# Altium schematic sheet USBC.SchDoc
size A4; SheetNumber: 3; SheetTotal: 8
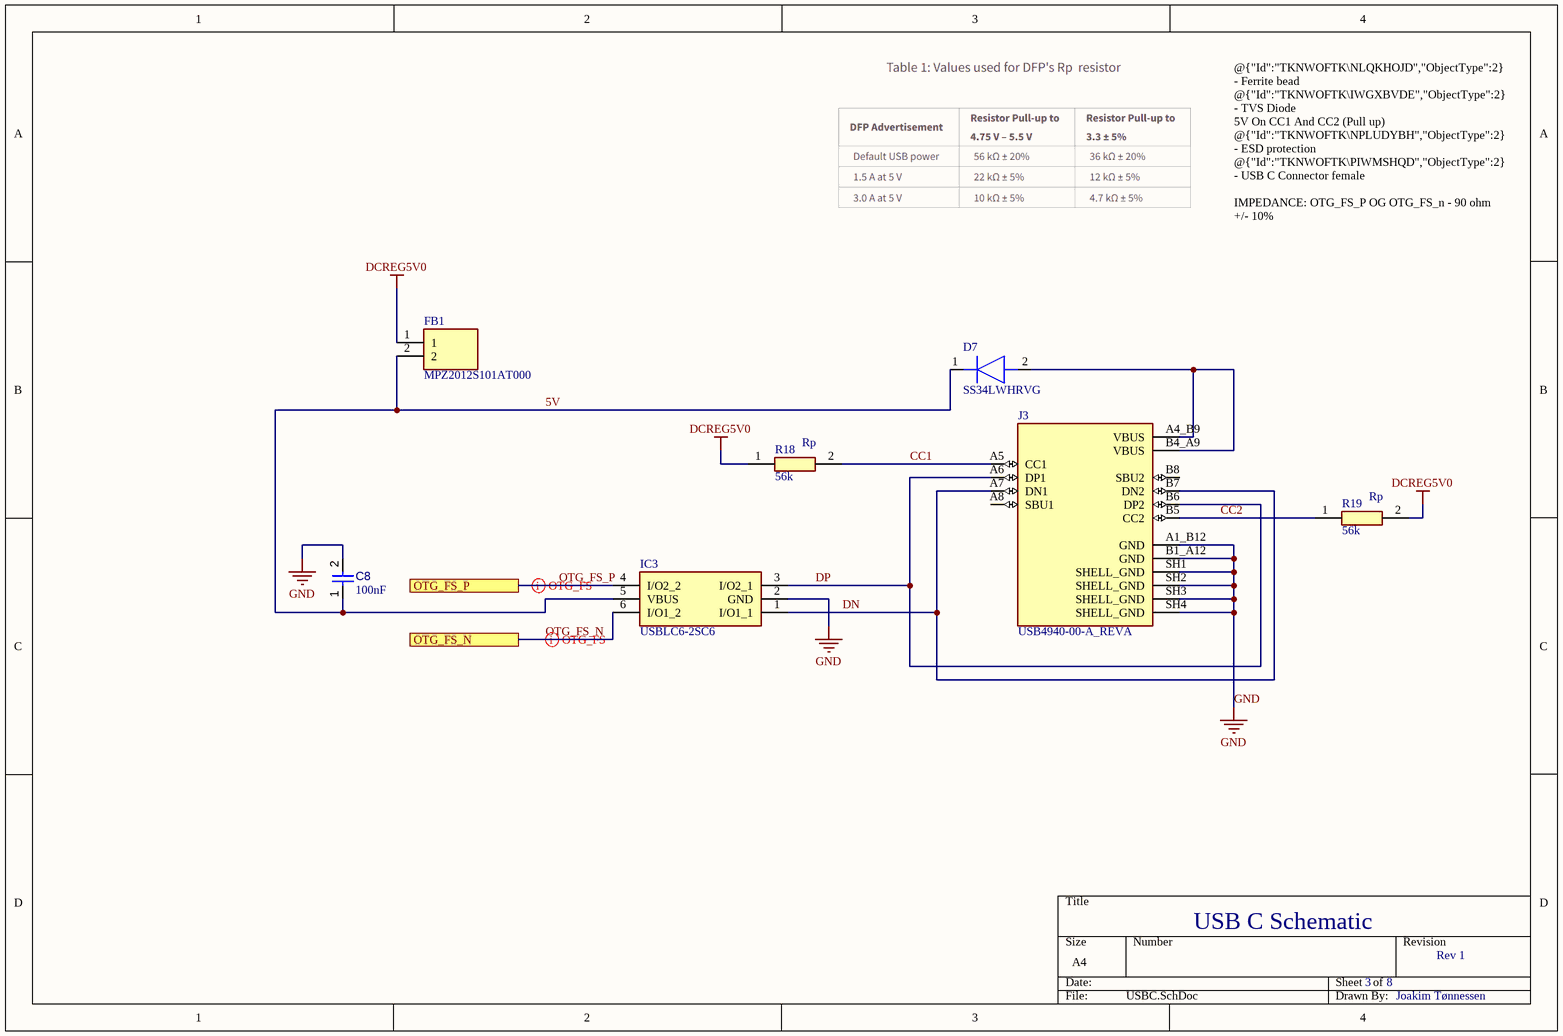
[diagram p0: USBC.SchDoc]

## Parts
C8  value 100nF  [CAPC2012X09N]  (hidden comment: 08053C104JAZ2A)
D7  SS34LWHRVG  [SODFL3718X102N]
FB1  MPZ2012S101AT000  [BEADC2012X105N]
IC3  USBLC6-2SC6  [SOT95P280X145-6N]
J3  USB4940-00-A_REVA  [GCT_USB4940-00-A_REVA]
R18  56k  [RESC1608X50N]
R19  56k  [RESC1608X50N]

## Ports
OTG_FS_N, OTG_FS_P

## Nets
DCREG5V0: FB1.1 R18.1 R19.2
GND: C8.2 IC3.2(GND) J3.A1_B12(GND) J3.B1_A12(GND) J3.SH1(SHELL_GND) J3.SH2(SHELL_GND) J3.SH3(SHELL_GND) J3.SH4(SHELL_GND)
5V: C8.1 D7.1(K) FB1.2 IC3.5(VBUS)
CC1: J3.A5(CC1) R18.2
CC2: J3.B5(CC2) R19.1
DN: IC3.1(I/O1_1) J3.A7(DN1) J3.B7(DN2)
DP: IC3.3(I/O2_1) J3.A6(DP1) J3.B6(DP2)
OTG_FS_N: IC3.6(I/O1_2) ; port OTG_FS_N
OTG_FS_P: IC3.4(I/O2_2) ; port OTG_FS_P
NetD7_2: D7.2(A) J3.A4_B9(VBUS) J3.B4_A9(VBUS)

Not connected (* = marked no-connect by the designer): J3 A8(SBU1) B8(SBU2)

## Layout directives
differential pair: OTG_FS_N, OTG_FS_P

## Notes on the sheet
- @{"Id":"TKNWOFTK\NLQKHOJD","ObjectType":2} - Ferrite bead
  @{"Id":"TKNWOFTK\IWGXBVDE","ObjectType":2} - TVS Diode
  5V On CC1 And CC2 (Pull up)
  @{"Id":"TKNWOFTK\NPLUDYBH","ObjectType":2} - ESD protection
  @{"Id":"TKNWOFTK\PIWMSHQD","ObjectType":2} - USB C Connector female
  IMPEDANCE: OTG_FS_P OG OTG_FS_n - 90 ohm +/- 10%
- (near R18) Rp
- (near R19) Rp
- USB C Schematic
- 3
- 8
- Rev 1
- Joakim Tønnessen

## Library data of the parts
C8 = CMP-001-00127-1: Cap Ceramic 0.1uF 25V X7R 5% SMD 0805 FlexiTerm 125°C Paper T/R; Case/Package: 0805; Max Operating Temperature: 125°C; Voltage Rating: 25V; Mounting Technology: Surface Mount; Pins: 2; Min Operating Temperature: -55°C; Tolerance: 5%
D7 = SS34LWHRVG: Diode; Manufacturer_Name: Taiwan Semiconductor; Datasheet Link: https://datasheet.datasheetarchive.com/originals/distributors/DKDS-20/389381.pdf; Height: 1.02mm; Manufacturer_Part_Number: SS34LWHRVG; Mouser Part Number: 821-SS34LWHRVG; Mouser Price/Stock: https://www.mouser.co.uk/ProductDetail/Taiwan-Semiconductor/SS34LWHRVG?qs=5aG0NVq1C4zYvYQjFNyRbA%3D%3D; Arrow Part Number: SS34LWHRVG; Arrow Price/Stock: https://www.arrow.com/en/products/ss34lwhrvg/taiwan-semiconductor?region=asia
FB1 = MPZ2012S101AT000: Ferrite Bead; Manufacturer_Name: TDK; Datasheet Link: https://product.tdk.com/system/files/dam/doc/product/emc/emc/beads/catalog/beads_commercial_power_mpz2012_en.pdf; Height: 1.05mm; Manufacturer_Part_Number: MPZ2012S101AT000; Mouser Part Number: 810-MPZ2012S101AT000; Mouser Price/Stock: https://www.mouser.co.uk/ProductDetail/TDK/MPZ2012S101AT000?qs=pLY5GE0xrmKpe1XYPmVCHA%3D%3D; Arrow Part Number: MPZ2012S101AT000; Arrow Price/Stock: https://www.arrow.com/en/products/mpz2012s101at000/tdk?utm_currency=USD&region=europe
IC3 = USBLC6-2SC6: Integrated Circuit; Manufacturer_Name: STMicroelectronics; Datasheet Link: https://www.st.com/resource/en/datasheet/usblc6-2.pdf; Height: 1.45mm; Manufacturer_Part_Number: USBLC6-2SC6; Mouser Part Number: 511-USBLC6-2SC6; Mouser Price/Stock: https://www.mouser.co.uk/ProductDetail/STMicroelectronics/USBLC6-2SC6?qs=po45yt2pPpu%2FhNIlwQdTlg%3D%3D; Arrow Part Number: USBLC6-2SC6; Arrow Price/Stock: https://www.arrow.com/en/products/usblc6-2sc6/stmicroelectronics?utm_currency=USD&region=europe
J3 = CMP-002-00134-1: Type C USB 2.0 Connector; MF: Global Connector Technology; Pins: 16; Source: USB4940-00-A_REVA.SchLib; Design Item ID: USB4940-00-A_REVA; Component Type: Standard; MP: USB4940-00-A; SnapEDA_Link: https://www.snapeda.com/parts/USB4940-00-A/Global+Connector+Technology/view-part/?ref=snap; Case/Package: None; Value: *; Check_prices: https://www.snapeda.com/parts/USB4940-00-A/Global+Connector+Technology/view-part/?ref=eda
R18 R19 = CRCW060356K0JNEA: Resistor / CRCW060356K0JNEA; Manufacturer_Name: Vishay; Datasheet Link: http://www.vishay.com/docs/20035/dcrcwe3.pdf; Height: 0.5mm; Manufacturer_Part_Number: CRCW060356K0JNEA; Mouser Part Number: 71-CRCW060356K0JNEA; Mouser Price/Stock: https://www.mouser.co.uk/ProductDetail/Vishay-Dale/CRCW060356K0JNEA?qs=H7dztQFVN2myA%252B1F5t9CIw%3D%3D